# Altium schematic sheet h bridge.SchDoc
size A4; SheetNumber: 9; SheetTotal: 9
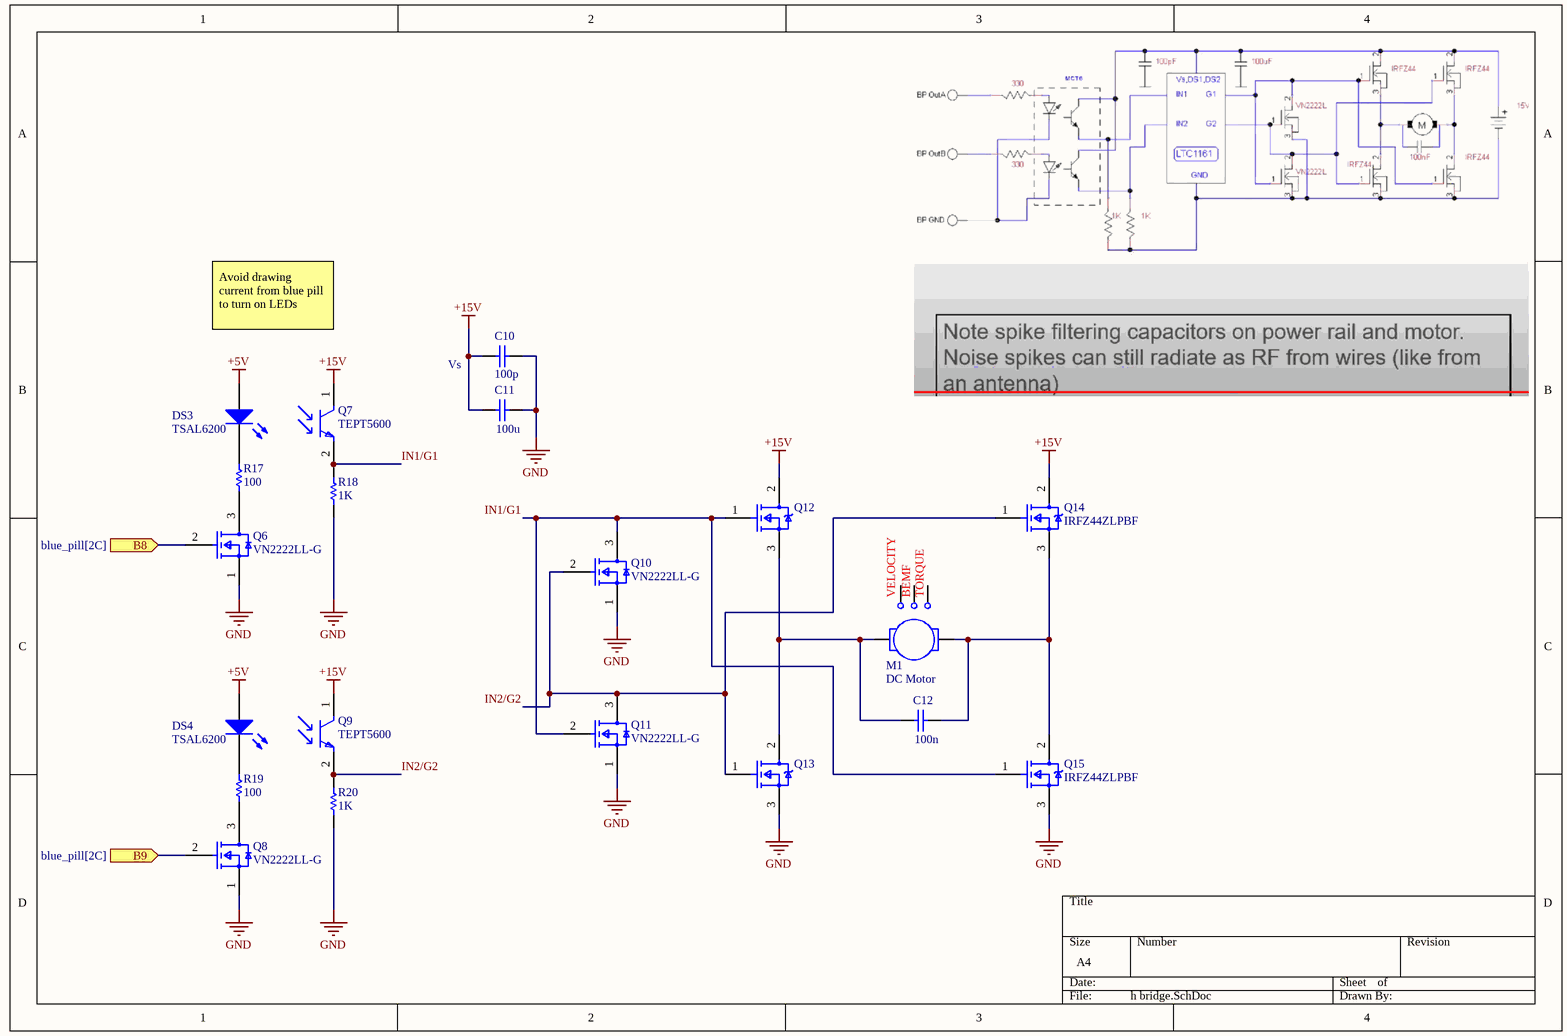
[diagram p0: h bridge.SchDoc]

## Parts
C10  value 100p  (hidden comment: Capacitor)
C11  value 100u  (hidden comment: Capacitor)
C12  value 100n  (hidden comment: Capacitor)
DS3  TSAL6200  [VISH-TSAL6200]
DS4  TSAL6200  [VISH-TSAL6200]
M1  DC Motor
Q6  VN2222LL-G  [FP-VN2222LL-G-MFG]
Q7  TEPT5600  [FP-6_544-5185_03-4-MFG]
Q8  VN2222LL-G  [FP-VN2222LL-G-MFG]
Q9  TEPT5600  [FP-6_544-5185_03-4-MFG]
Q10  VN2222LL-G  [FP-VN2222LL-G-MFG]
Q11  VN2222LL-G  [FP-VN2222LL-G-MFG]
Q12  IRFZ44ZLPBF  [FP-PG-TO262-3-MFG]  (value not drawn)
Q13  IRFZ44ZLPBF  [FP-PG-TO262-3-MFG]  (value not drawn)
Q14  IRFZ44ZLPBF  [FP-PG-TO262-3-MFG]
Q15  IRFZ44ZLPBF  [FP-PG-TO262-3-MFG]
R17  value 100  (hidden comment: Resistor)
R18  value 1K  (hidden comment: Resistor)
R19  value 100  (hidden comment: Resistor)
R20  value 1K  (hidden comment: Resistor)

## Ports
B8 (in, see blue_pill[2C]), B9 (in, see blue_pill[2C])

## Nets
+5V: DS3.1(A) DS4.1(A)
+15V: C10.1 C11.1 Q7.1(C) Q9.1(C) Q12.2(D) Q14.2(D)
GND: C10.2 C11.2 Q6.1(SOURCE) Q8.1(SOURCE) Q10.1(SOURCE) Q11.1(SOURCE) Q13.3(S) Q15.3(S) R18.2 R20.2
B8: Q6.2(GATE) ; port B8
B9: Q8.2(GATE) ; port B9
IN1/G1: Q7.2(E) Q10.3(DRAIN) Q11.2(GATE) Q12.1(G) Q15.1(G) R18.1
IN2/G2: Q9.2(E) Q10.2(GATE) Q11.3(DRAIN) Q13.1(G) Q14.1(G) R20.1
NetC12_1: C12.1 M1.1 Q12.3(S) Q13.2(D)
NetC12_2: C12.2 M1.2 Q14.3(S) Q15.2(D)
NetDS3_2: DS3.2(K) R17.1
NetDS4_2: DS4.2(K) R19.1
NetQ6_3: Q6.3(DRAIN) R17.2
NetQ8_3: Q8.3(DRAIN) R19.2

Not connected (* = marked no-connect by the designer): M1 3 4 5

## Notes on the sheet
- Avoid drawing current from blue pill to turn on LEDs
- Vs
- (in symbol DC Motor) VELOCITY; BEMF; TORQUE

## Library data of the parts
C10-C12 = Capacitor: SimulationGenericComponent: True
DS3 DS4 = CMP-2000-07327-1: High Power Infrared Emitting Diode, GaAlAs, MQW, 1.35 V, 100 mA, -40 to 85 degC, 2-Pin THD, RoHS, Bulk; Manufacturer: Vishay; Lum Intensity: 500mW/srmcd; Product Depth (mm): 5.8mm; Type: IrLED; Luminous Intensity: 500mW/sr; Forward Voltage: 3V; Shape Type: Circular; Peak Wavelength: 950nm; Rad Hardened: No; Product Height (mm): 8.7mm; Number of  Elements: 1; Forward Current: 100mA; High Brightness: Yes; Reverse Voltage: 5V; DELETED: Compliant; Power Dissipation: 160W; Viewing Angle: 34deg; Lens Type: Colored; Packaging: Bulk; Lens Dimensions: 5x5x7.7mm; Package Reference: TSAL6200; Chip Material: GaAlAs; Package Description: 2-Pin Through Hole Device, Dia 5.8 mm, Pitch 2.54 mm; Main Category: IrLED; Manufacturer URL: http://www.vishay.com/; Product Length (mm): 5.8mm; Datasheet URL: http://www.vishay.com/docs/81010/tsal6200.pdf; Operating Temperature Classification: Industrial; Package Type: T-13/4; Pin Count: 2; Mounting: ThroughHole; Mounting Technology: ThroughHole; Test Current (It): 100mA; Datasheet Version: Rev. 2.4, 03/2014; Operating Temp Range: -40Cto85C
M1 = DC Motor: LA: 1.5M; RA: 0.5; KE: 0.05; JM: 250U; BM: 0.1M; TL: 0; SimulationGenericComponent: True; KT: 0.05
Q6 Q8 Q10 Q11 = CMP-06369-000005-1: MOSFET N-CH 60V 0.23A TO92-3; Gate to Source Voltage (Vgs): 30V; Number of Elements: 1; Continuous Drain Current (ID): 230mA; Drain to Source Resistance: 7.5R; Element Configuration: Single; Power Dissipation: 1W; Max Operating Temperature: 150°C; Mount: Through Hole; Radiation Hardening: No; Lead Free: Lead Free; Number of Pins: 3; Packaging: Bulk; Package Quantity: 1000; Min Operating Temperature: -55°C; Case/Package: TO-92; Drain to Source Breakdown Voltage: 60V
Q7 Q9 = CMP-02533-000004-1: SENSOR PHOTO 570NM TOP VIEW RAD; Number of Channels: 1; Collector Emitter Voltage (VCEO): 6V; Output Type: Analog; Power Consumption: 100mW; Max Collector Current: 20mA; Lens Style: Domed; Polarity: NPN; Dark Current: 50nA; Viewing Angle: 20°; Operating Supply Voltage: 5V; Package Material: SILICON; Wavelength: 570nm; Width: 5.75mm; Power Dissipation: 100mW; Package Quantity: 4000; Radiation Hardening: No; RoHS Compliant: Yes; Lead Free: Lead Free; Max Power Dissipation: 100mW; Max Operating Temperature: 85°C; Length: 5.75mm; Case/Package: Radial; Number of Elements: 1; Number of Pins: 2; Min Operating Temperature: -40°C; Mount: Through Hole; Height: 8mm; Orientation: Top View; Series: -; Collector Emitter Breakdown Voltage: 6V; Packaging: Bulk
Q12-Q15 = CMP-32901-000428-1: MOSFET N-CH 55V 51A TO262; Input Capacitance: 1.42nF; Drain to Source Resistance: 13.9mR; Gate to Source Voltage (Vgs): 20V; Turn-Off Delay Time: 33ns; Power Dissipation: 80W; Element Configuration: Single; Turn-On Delay Time: 14ns; Continuous Drain Current (ID): 51A; Max Operating Temperature: 175°C; Max Dual Supply Voltage: 55V; Drain to Source Voltage (Vdss): 55V; RoHS Compliant: Yes; Halogen Free: Halogen Free; Rds On Max: 13.9mR; Mount: Through Hole; Width: 0.19inch; Min Operating Temperature: -55°C; Length: 0.419inch; Lead Free: Contains Lead; Max Power Dissipation: 80W; Packaging: Rail/Tube; Height: 0.355inch; Number of Pins: 3; Case/Package: TO-262
R17-R20 = Resistor: TC1: 0; SimulationGenericComponent: True; TC2: 0